# EAGLE design mccd (EAGLE 7.2.0)
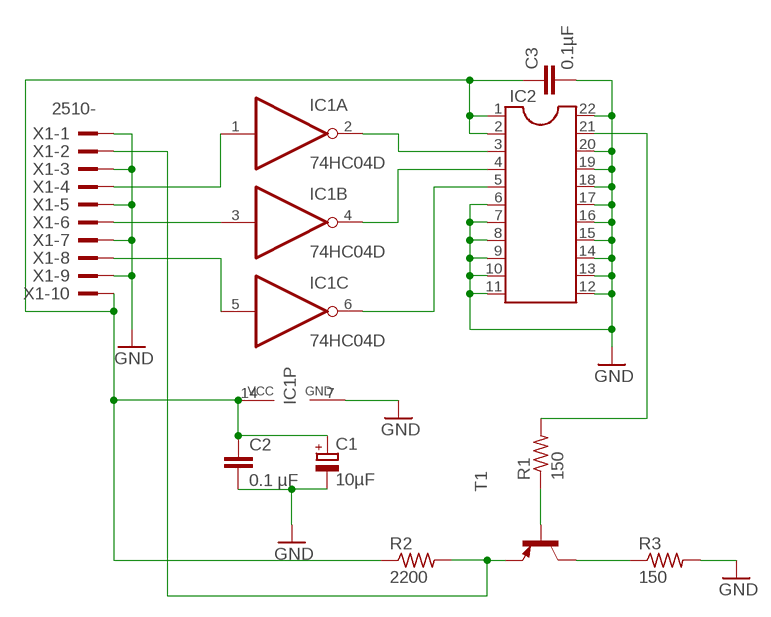
[diagram p0: schematic, sheet 1]

## Parts
C1  10µF  CPOL-EUD  [PANASONIC_D]
C2  0.1 µF  C-EUC1206  [C1206]
C3  0.1µF  C-EUC1206  [C1206]
IC1  74HC04D  [SO14]
IC2  DIL22-4  [DIL22-4]
R1  150  R-US_M1206  [M1206]
R2  2200  R-US_M1206  [M1206]
R3  150  R-US_M1206  [M1206]
T1  -PNP-TO92-BCE  [TO92-BCE]
X1  2510-  [PAK100/2500-10]

## Nets
GND: C1.- C2.2 C3.2 IC1.7(P:GND) IC2.6 IC2.7 IC2.8 IC2.9 IC2.10 IC2.11 IC2.12 IC2.13 IC2.14 IC2.15 IC2.16 IC2.17 IC2.18 IC2.19 IC2.20 IC2.22 R3.2 X1.1 X1.3 X1.5 X1.7 X1.9
N$1: R2.2 T1.E X1.2
N$2: IC1.2(A:O) IC2.3
N$3: IC1.4(B:O) IC2.4
N$4: IC1.6(C:O) IC2.5
N$5: R3.1 T1.C
N$6: R1.1 T1.B
N$7: C1.+ C2.1 C3.1 IC1.14(P:VCC) IC2.1 IC2.2 R2.1 X1.10
N$8: IC2.21 R1.2
N$9: IC1.5(C:I) X1.8
N$10: IC1.3(B:I) X1.6
N$11: IC1.1(A:I) X1.4
Unconnected: IC1.8(D:O) IC1.9(D:I) IC1.10(E:O) IC1.11(E:I) IC1.12(F:O) IC1.13(F:I)

## Library data of the parts
C1 = resistor:CPOL-EU: POLARIZED CAPACITOR, European symbol
C2 C3 = resistor:C-EU: CAPACITOR, European symbol
IC1 = 74xx-eu:74*04: Hex INVERTER
IC2 = ic-package:DIL22: Dual In Line / Socket
R1-R3 = resistor:R-US_: RESISTOR, American symbol
T1 = transistor-neu-to92:*-PNP-: PNP Transistror
X1 = con-3m:2510-: 3M (TM) Pak 100 4-Wall Header Source: 3M; MF: 3M; MPN: 2510-6002UB; OC_FARNELL: 9838244; OC_NEWARK: 46F4725

## Board
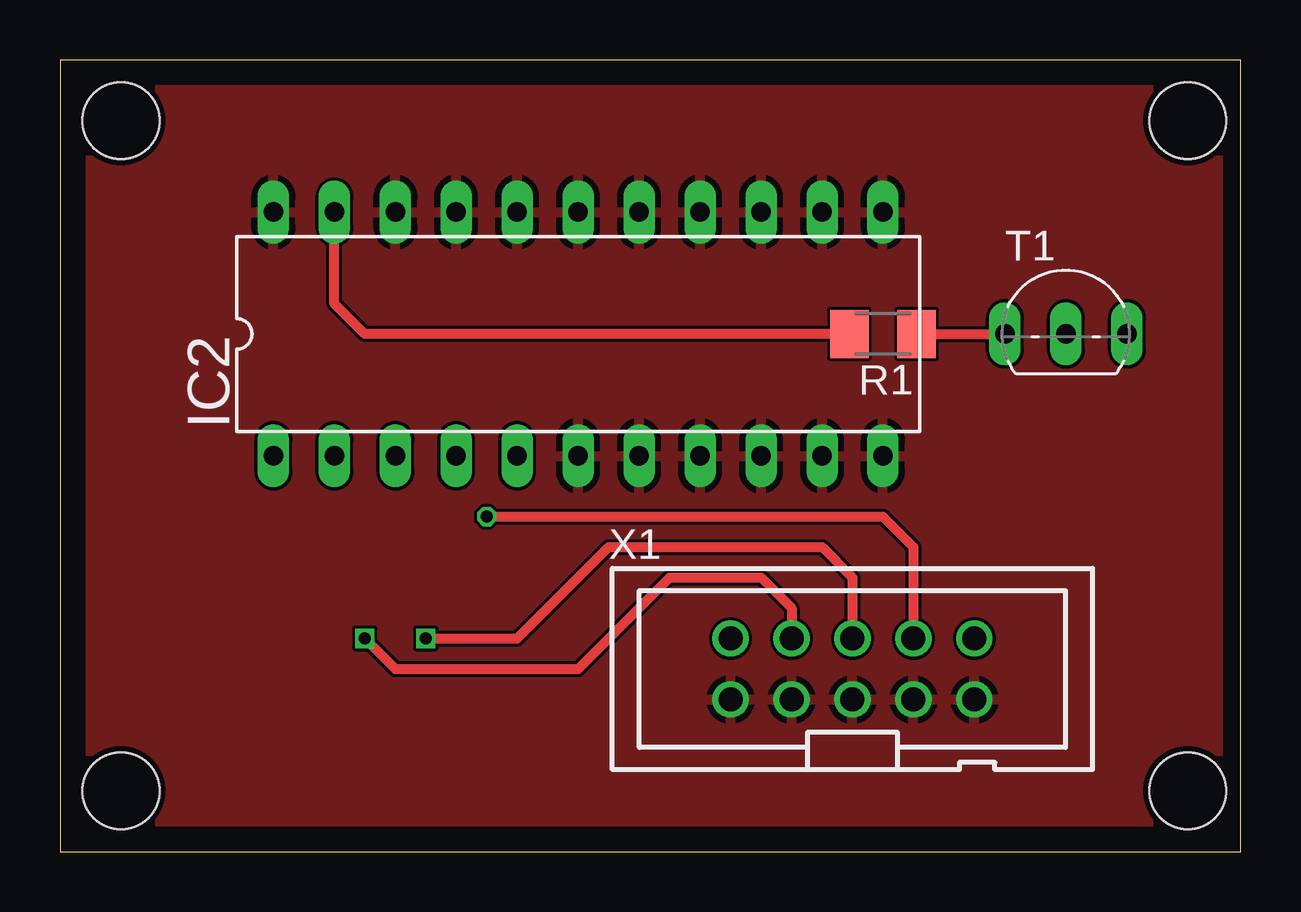
[diagram p1: board, top side]
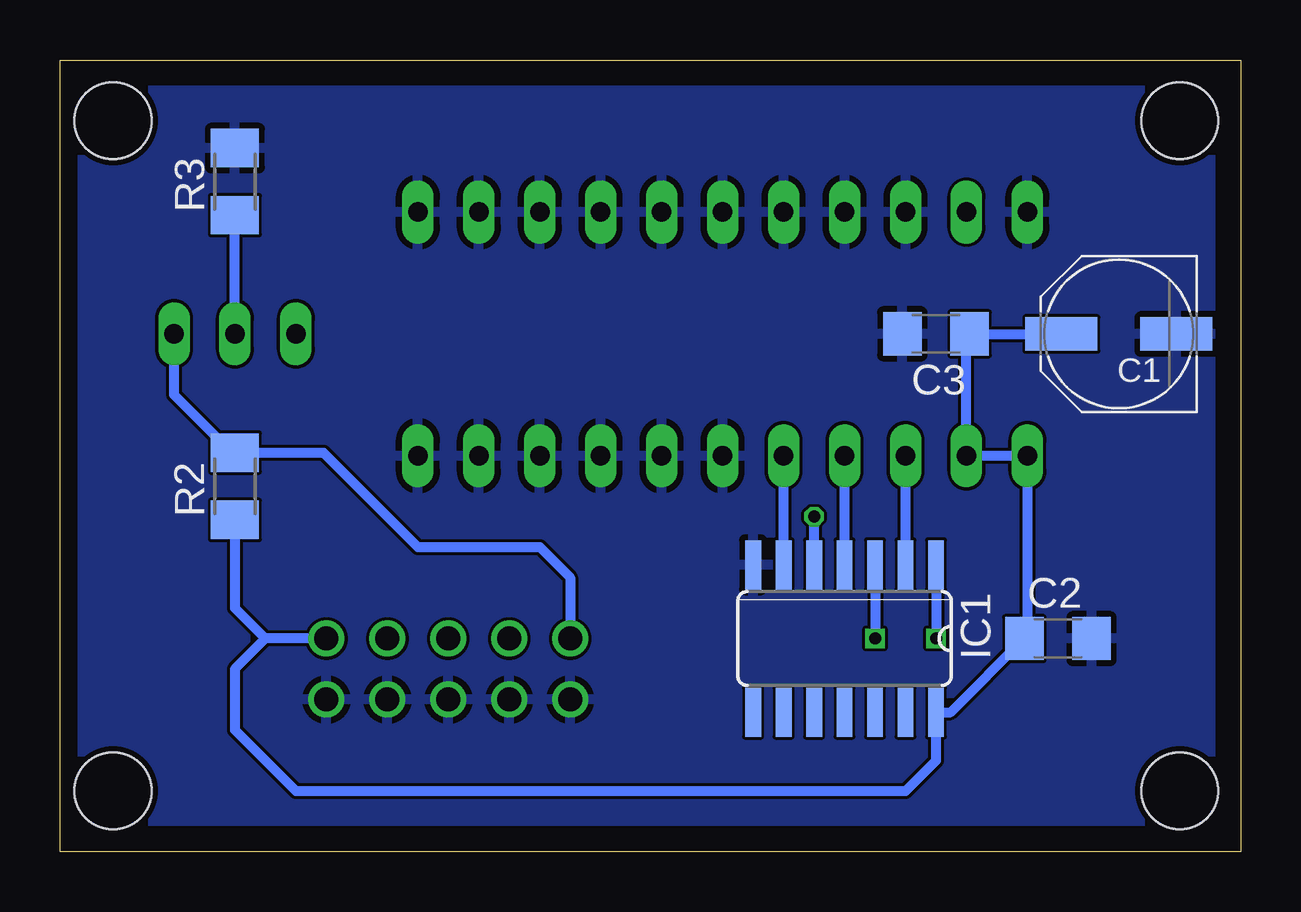
[diagram p2: board, bottom side, seen from below]

Size 49.2 x 33.01 mm. Coordinates in mm from the lower left corner, seen from the top.
Outline: 0,0 49.2,0 49.2,33.01 0,33.01 0,0
Copper layers (1*16): Top 0.035mm / dielectric 1.5mm / Bottom 0.035mm
Design rules "dirt_cheap_dirty_boards.v1": minimum track width 5mil, minimum drill 12mil, track to track 5mil, track to pad 5mil, pad to pad 5mil, via to via 5mil, smd to smd 0mil, copper to edge 10mil, drill to drill 10mil, minimum pad ring 10mil, minimum via ring 6mil, stop-mask expansion 2mil, vias tented up to drill 25mil, thermal gap 10mil
Holes 3.2 mm at 2.54,30.48 46.99,30.48 46.99,2.54 2.54,2.54

### Footprints (pad centres in the part's own frame; a part is rotated, then mirrored left to right if it is on the bottom)
PANASONIC_D = smd 3 x 1.4: + 2.4,0; - -2.4,0
C1206 = smd 1.6 x 1.8: 1 -1.4,0; 2 1.4,0
SO14 = smd 0.66 x 2.032: 1 -3.81,-3.073; 2 -2.54,-3.073; 3 -1.27,-3.073; 4 0,-3.073; 5 1.27,-3.073; 6 2.54,-3.073; 7 3.81,-3.073; 8 3.81,3.073; 9 2.54,3.073; 10 1.27,3.073; 11 0,3.073; 12 -1.27,3.073; 13 -2.54,3.073; 14 -3.81,3.073
DIL22-4 = drill 0.813 long: 1 -12.7,-5.08; 2 -10.16,-5.08; 3 -7.62,-5.08; 4 -5.08,-5.08; 5 -2.54,-5.08; 6 0,-5.08; 7 2.54,-5.08; 8 5.08,-5.08; 9 7.62,-5.08; 10 10.16,-5.08; 11 12.7,-5.08; 12 12.7,5.08; 13 10.16,5.08; 14 7.62,5.08; 15 5.08,5.08; 16 2.54,5.08; 17 0,5.08; 18 -2.54,5.08; 19 -5.08,5.08; 20 -7.62,5.08; 21 -10.16,5.08; 22 -12.7,5.08
M1206 = smd 1.6 x 2: 1 -1.4,0; 2 1.4,0
TO92-BCE = drill 0.813 long: B -2.54,0; C 0,0; E 2.54,0
PAK100/2500-10 = drill 1 pad 1.422: 1 -5.08,-1.27; 2 -5.08,1.27; 3 -2.54,-1.27; 4 -2.54,1.27; 5 0,-1.27; 6 0,1.27; 7 2.54,-1.27; 8 2.54,1.27; 9 5.08,-1.27; 10 5.08,1.27

### Placement (x,y rotation side)
C1  5.08,21.59 180 bottom
C2  7.62,8.89 0 bottom
C3  12.7,21.59 180 bottom
IC1  16.51,8.89 180 bottom
IC2  21.59,21.59 0 top
R1  34.29,21.59 180 top
R2  41.91,15.24 90 bottom
R3  41.91,27.94 90 bottom
T1  41.91,21.59 0 top
X1  33.02,7.62 0 top

### Tracks (layer width: path | path; a pad name or v marks a point on that pad's centre or on a via)
GND
  pour Bottom: 1.27,31.75 1.27,1.27 48.26,1.27 48.26,31.75
  pour Top: 1.27,31.75 1.27,1.27 48.26,1.27 48.26,31.75
N$1
  Bottom 0.406: T1.E 44.45,19.05 42.04,16.64 R2.2 38.23,16.64 34.29,12.7 29.21,12.7 27.94,11.43 X1.2
N$2
  Bottom 0.406: IC1.2 IC2.3
N$3
  Bottom 0.406: IC1.4 IC2.4
N$4
  Bottom 0.406: IC1.6 IC2.5
N$5
  Bottom 0.406: T1.C R3.1
N$6
  Top 0.406: R1.1 T1.B
N$7
  Bottom 0.406: C1.+ C3.1 11.43,21.46 IC2.2 IC2.1 8.89,9.02 C2.1 12.09,5.82 IC1.14 12.7,3.81 13.97,2.54 39.37,2.54 41.91,5.08 41.91,7.62 40.64,8.89 | X1.10 40.64,8.89 | R2.1 41.91,10.16 40.64,8.89
N$8
  Top 0.406: R1.2 12.7,21.59 11.43,22.86 IC2.21
N$9  (via drill 0.5)
  Top 0.406: v17.78,13.97 34.29,13.97 35.56,12.7 X1.8
  Bottom 0.406: IC1.5 v17.78,13.97
N$10  (via drill 0.5)
  Top 0.406: v15.24,8.89 19.05,8.89 22.86,12.7 31.75,12.7 33.02,11.43 X1.6
  Bottom 0.406: IC1.3 v15.24,8.89
N$11  (via drill 0.5)
  Top 0.406: v12.7,8.89 13.97,7.62 21.59,7.62 25.4,11.43 29.21,11.43 30.48,10.16 X1.4
  Bottom 0.406: IC1.1 v12.7,8.89